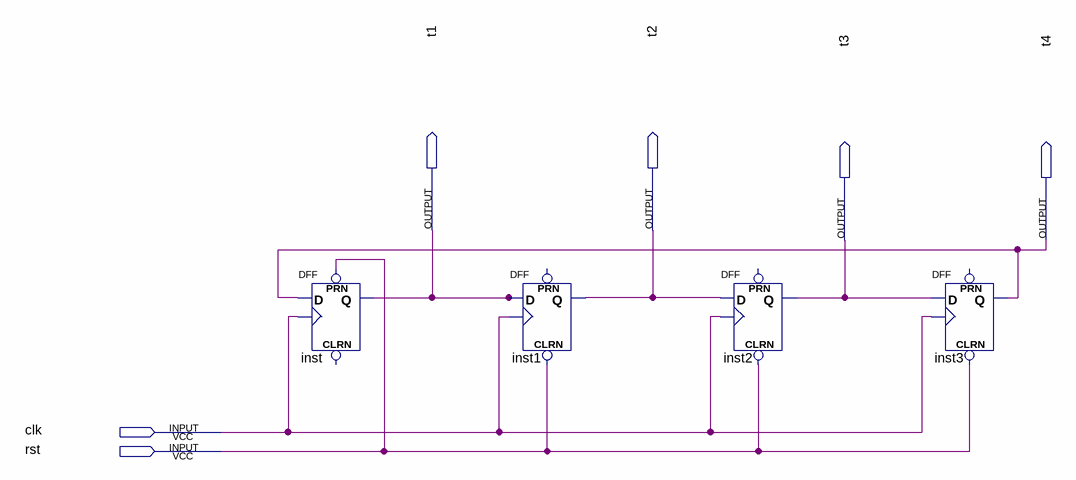
[diagram p0: schematic sheet]
// Quartus schematic exp11.bdf as structural Verilog: 4 symbols, 6 pins
module exp11 (
  input  clk,
  input  rst,
  output t1,
  output t2,
  output t3,
  output t4
);

  DFF inst (.CLK(clk), .D(t4), .PRN(rst), .Q(t1));  // open: CLRN
  DFF inst1 (.CLRN(rst), .CLK(clk), .D(t1), .Q(t2));  // open: PRN
  DFF inst2 (.CLRN(rst), .CLK(clk), .D(t2), .Q(t3));  // open: PRN
  DFF inst3 (.CLRN(rst), .CLK(clk), .D(t3), .Q(t4));  // open: PRN
endmodule
